# Altium project Hygrometer.PrjPcb
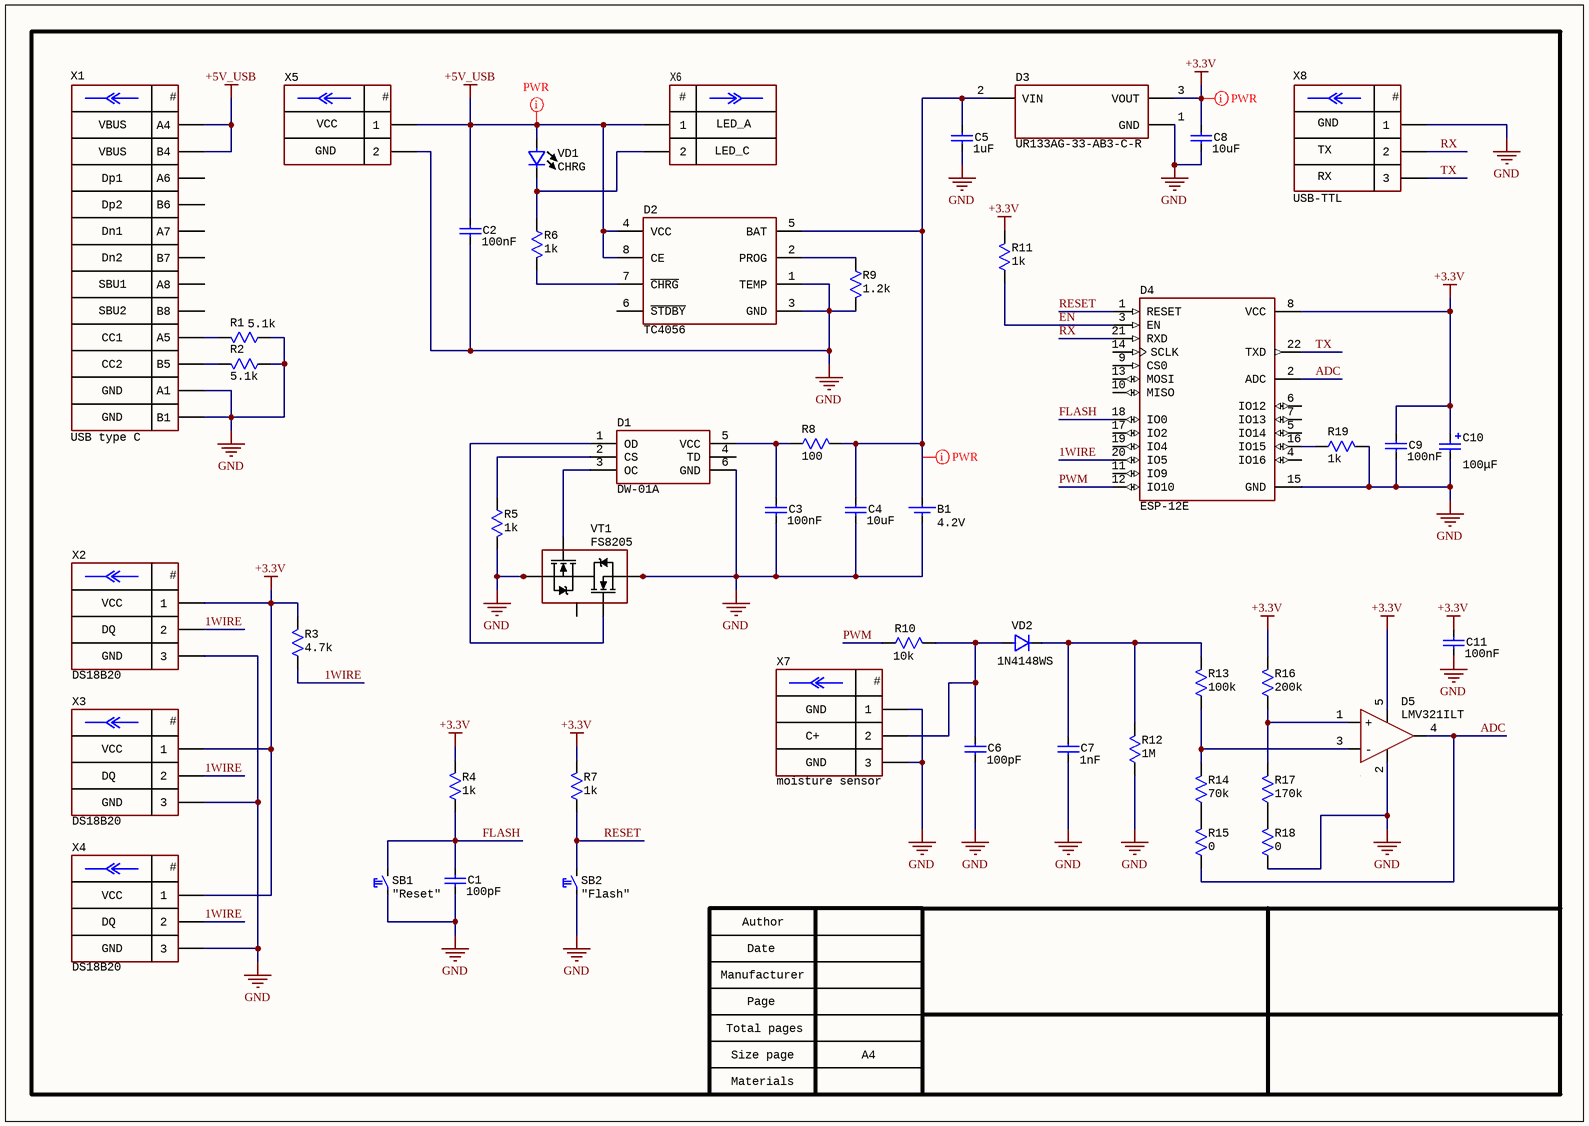
[diagram p0: Hygrometer.SchDoc]
1 sheet, 49 parts. Net scope: global (net labels, ports and power ports of the same name join across sheets).
Board file: Hygrometer.PcbDoc

## Sheet Hygrometer.SchDoc: =GlobalProjectName
size 297 x 209 mm; Scale: 1:1; Title2str: sdf; DocumentType: Схема электрическая принципиальная; FirstReferrence: АБВГ.123456.001; ApprovedBy: Утвердил; CheckedBy: Проверил; Author: Разработал; SheetNumber: 1; SheetTotal: 1; PageSetup: Record=PageOptions|CenterHorizontal=True|CenterVertical=True|PrintScale=1.00|XCorrection=1.00|YCorrection=1.00|PrintKind=1|BorderSize=5000000|LeftOffset=0|BottomOffset=0|Orientation=2|PaperLength=1000|PaperWidth=1000|Scale=100|PaperSource=15|PrintQuality=1200|MediaType=1|DitherType=10|PaperKind=A3|PrintScaleMode=1; Weight: -; ScaleFactor: -; NormInspection: Норм.Контр.

### Parts
B1  VoltageMax: 4.2V  [CON: HOLDER 18650 x1]
C1  value 100pF  [CAP: 0402]
C2  value 100nF  [CAP: 0402]
C3  value 100nF  [CAP: 0402]
C4  value 10uF  [CAP: 0805]
C5  value 1uF  [CAP: 0402]
C6  value 100pF  [CAP: 0402]
C7  value 1nF  [CAP: 0402]
C8  value 10uF  [CAP: 0805]
C9  value 100nF  [CAP: 0402]
C10  value 100μF  [CAP: TANTAL-C]
C11  value 100nF  [CAP: 0402]
D1  DW-01A  [SOT23-6]
D2  TC4056  [8-SOIC]
D3  (no value)  [SOT-89]
D4  ESP-12E  [ESP-12E]
D5  LMV321ILT  [SOT23-5]
R1  value 5.1k  [RES: 0402]
R2  value 5.1k  [RES: 0402]
R3  value 4.7k  [RES: 0402]
R4  value 1k  [RES: 0402]
R5  value 1k  [RES: 0402]
R6  value 1k  [RES: 0402]
R7  value 1k  [RES: 0402]
R8  value 100  [RES: 0402]
R9  value 1.2k  [RES: 0402]
R10  value 10k  [RES: 0402]
R11  value 1k  [RES: 0402]
R12  value 1M  [RES: 0402]
R13  value 100k  [RES: 0402]
R14  value 70k  [RES: 0402]
R15  value 0  [RES: 0402]
R16  value 200k  [RES: 0402]
R17  value 170k  [RES: 0402]
R18  value 0  [RES: 0402]
R19  value 1k  [RES: 0402]
SB1  CommentText: "Reset"  [BUT: 6x3.5 SMD]
SB2  CommentText: "Flash"  [BUT: 6x3.5 SMD]
VD1  Color: CHRG  [LED: 0402B]
VD2  PartNumber: 1N4148WS  [DIODE: SOD323]
VT1  (no value)  [8-TSOP]
X1  CommentText: USB type C  [CON: TYPE-C-31-M-12]
X2  DS18B20  [CON: PLS-3]
X3  DS18B20  [CON: PLS-3]
X4  DS18B20  [CON: PLS-3]
X5  (no value)  [CON: DG350-3.5-02P]
X6  (no value)  [CON: PLS-2]
X7  moisture sensor  [CON: PLS-3]
X8  USB-TTL  [CON: PLS-3]

### Nets
+3.3V: C8.1 C9.1 C10.1 C11.1 D3.3(VOUT) D4.8(VCC) D5.5 R3.2 R4.2 R7.2 R11.2 R16.2 X2.1 X3.1 X4.1
+5V_USB: C2.1 D2.4(VCC) D2.8(CE) VD1.1 X1.A4 X1.B4 X5.1 X6.1
GND: B1.2(-) C1.2 C2.2 C3.2 C4.2 C5.2 C6.2 C7.2 C8.2 C9.2 C10.2 C11.2 D1.6(GND) D2.1(TEMP) D2.3(GND) D3.1(GND) D4.15(GND) D5.2 R1.1 R2.1 R5.2 R9.2 R12.1 R18.1 R19.2 SB1.1 SB2.1 VT1.2(S1) VT1.3(S1) VT1.6(S2) VT1.7(S2) X1.A1 X1.B1 X2.3 X3.3 X4.3 X5.2 X7.1 X7.3 X8.1
1WIRE: D4.20(IO5) R3.1 X2.2 X3.2 X4.2
ADC: D4.2(ADC) D5.4 R15.1
EN: D4.3(EN) R11.1
FLASH: C1.1 D4.18(IO0) R4.1 SB1.2
PWM: D4.12(IO10) R10.1
RESET: D4.1(RESET) R7.1 SB2.2
RX: D4.21(RXD) X8.2
TX: D4.22(TXD) X8.3
NetB1_1: B1.1(+) C4.1 C5.1 D2.5(BAT) D3.2(VIN) R8.2
NetC3_1: C3.1 D1.5(VCC) R8.1
NetC6_1: C6.1 R10.2 VD2.1 X7.2
NetC7_1: C7.1 R12.2 R13.2 VD2.2
NetD1_1: D1.1(OD) VT1.5(G2)
NetD1_2: D1.2(CS) R5.1
NetD1_3: D1.3(OC) VT1.4(G1)
NetD2_2: D2.2(PROG) R9.1
NetD2_7: D2.7(~{CHRG}) R6.2
NetD4_16: D4.16(IO15) R19.1
NetD5_1: D5.1(+) R16.1 R17.2
NetD5_3: D5.3(-) R13.1 R14.2
NetR1_2: R1.2 X1.A5
NetR2_2: R2.2 X1.B5
NetR6_1: R6.1 VD1.2 X6.2
NetR14_1: R14.1 R15.2
NetR17_1: R17.1 R18.2
NetVT1_1: VT1.1(D12) VT1.8(D12)

Not connected (* = marked no-connect by the designer): D1 4(TD); D2 6(~{STDBY}); D4 4(IO16) 5(IO14) 6(IO12) 7(IO13) 9(CS0) 10(MISO) 11(IO9) 13(MOSI) 14(SCLK) 17(IO2) 19(IO4); X1 A6 A7 A8 B6 B7 B8

### Layout directives
net class PWR: +3.3V, +5V_USB, NetB1_1

### Notes on the sheet
- VCC
- (near X6) LED_A
- GND
- (near X6) LED_C
- RX
- TX
- DQ
- C+
- Author
- Manufacturer
- Date
- Page
- Total pages
- Size page
- A4
- Materials
- (in symbol Connector_terminal_2pin) #
- (in symbol Connector_USB_Type_C) #; VBUS; Dp1; Dp2; Dn1; Dn2; SBU1; SBU2; CC1; CC2; GND
- (in symbol PLS-2) #
- (in symbol PLS-3) #

### Library data of the parts
B1 = Holder_18650_1: Manufacturer: ALLOYSEED; ValueManufacturerPartNumber: Single holder 18650, 4.2V; PartNumber: Holder 18650; TypeConnector: Single holder 18650; HelpURL: https://ru.aliexpress.com/item/32814062027.html?spm=2114.13010708.0.0.498333edwmS6ak
C1 C6 = Ceramic: Manufacturer: Yageo; PartNumber: CC0201KRX7R7BB103; ValueManufacturerPartNumber: Ceramic capacitor, 100pF, X7R, ±10%, 16V, 0201, -55...+125°C; TypeCapacitor: Ceramic capacitor; Tolerance: ±10%; TypeDielectric: X7R; Voltage: 16V; Package: 0201; HelpURL: https://www.digikey.com/product-detail/en/yageo/CC0201KRX7R7BB103/311-1404-1-ND/2833710; Temperature: -55...+125°C
C2 C3 C9 C11 = Ceramic: Manufacturer: Yageo; PartNumber: CC0201KRX7R7BB103; ValueManufacturerPartNumber: Ceramic capacitor, 100nF, X7R, ±10%, 16V, 0201, -55...+125°C; TypeCapacitor: Ceramic capacitor; Tolerance: ±10%; TypeDielectric: X7R; Voltage: 16V; Package: 0201; HelpURL: https://www.digikey.com/product-detail/en/yageo/CC0201KRX7R7BB103/311-1404-1-ND/2833710; Temperature: -55...+125°C
C4 C8 = Ceramic: Manufacturer: Yageo; PartNumber: CC0201KRX7R7BB103; ValueManufacturerPartNumber: Ceramic capacitor, 10uF, X7R, ±10%, 16V, 0201, -55...+125°C; TypeCapacitor: Ceramic capacitor; Tolerance: ±10%; TypeDielectric: X7R; Voltage: 16V; Package: 0201; HelpURL: https://www.digikey.com/product-detail/en/yageo/CC0201KRX7R7BB103/311-1404-1-ND/2833710; Temperature: -55...+125°C
C5 = Ceramic: Manufacturer: Yageo; PartNumber: CC0201KRX7R7BB103; ValueManufacturerPartNumber: Ceramic capacitor, 1uF, X7R, ±10%, 16V, 0201, -55...+125°C; TypeCapacitor: Ceramic capacitor; Tolerance: ±10%; TypeDielectric: X7R; Voltage: 16V; Package: 0201; HelpURL: https://www.digikey.com/product-detail/en/yageo/CC0201KRX7R7BB103/311-1404-1-ND/2833710; Temperature: -55...+125°C
C7 = Ceramic: Manufacturer: Yageo; PartNumber: CC0201KRX7R7BB103; ValueManufacturerPartNumber: Ceramic capacitor, 1nF, X7R, ±10%, 16V, 0201, -55...+125°C; TypeCapacitor: Ceramic capacitor; Tolerance: ±10%; TypeDielectric: X7R; Voltage: 16V; Package: 0201; HelpURL: https://www.digikey.com/product-detail/en/yageo/CC0201KRX7R7BB103/311-1404-1-ND/2833710; Temperature: -55...+125°C
C10 = Tantal: Manufacturer: AVX; PartNumber: F930J107KAAAJ6; ValueManufacturerPartNumber: Tantalum capacitor, 100μF, 6.3V, ±10%, 2Ohm, case A (3216), -55...+125°C; Impedance: 2Ohm; Tolerance: ±10%; TypeDielectric: X7R; TypeCapacitor: Tantalum capacitor; Voltage: 6.3V; Package: case A (3216); HelpURL: https://www.digikey.com/product-detail/en/avx-corporation/F930J107KAAAJ6/478-12404-1-ND/9645231; Temperature: -55...+125°C
D1 = DW-01A: No Charging Interruption Due to Input Voltage Fluctuation, 4.5 to 6.5 V Vin, 8-pin SOT23 (TS8-8), -40 to 85 degC, Pb-Free, Mini Tape and Reel; PartNumber: LTC4056ETS8-4.2#TRMPBF; Manufacturer: Linear Technology; Max Charge Current(A): 0.7; Vin Max(V): 6.5; Battery Chemistry: Li-Ion, Li-Polymer; Number of Cells: 1; Charge Termination: On-board timer; Float Voltage: 4.2 V; Type of Charger: Linear; Vin Min(V): 4.5; Mounting Technology: Surface Mount; PackageVersion: Rev. A, 08/2010; ComponentLink3Description: Package Specification; Packing: Mini Tape and Reel; PackageReference: TS8-8; ComponentLink2URL: http://cds.linear.com/docs/en/datasheet/405642f.pdf; PackageDescription: 8-Pin Plastic TSOT-23, Body 2.9 x 1.63 mm, Pitch 0.65 mm; ComponentLink2Description: Datasheet; Code_JEDEC: MO-193; ComponentLink3URL: http://cds.linear.com/docs/en/packaging/SOT_8_05-08-1637.pdf; ComponentLink1Description: Manufacturer URL; ComponentLink1URL: http://www.linear.com/; RoHS: TRUE
D2 = TC4056: No Charging Interruption Due to Input Voltage Fluctuation, 4.5 to 6.5 V Vin, 8-pin SOT23 (TS8-8), -40 to 85 degC, Pb-Free, Mini Tape and Reel; PartNumber: LTC4056ETS8-4.2#TRMPBF; Manufacturer: Linear Technology; Max Charge Current(A): 0.7; Vin Max(V): 6.5; Battery Chemistry: Li-Ion, Li-Polymer; Number of Cells: 1; Charge Termination: On-board timer; Float Voltage: 4.2 V; Type of Charger: Linear; Vin Min(V): 4.5; Mounting Technology: Surface Mount; PackageVersion: Rev. A, 08/2010; ComponentLink3Description: Package Specification; Packing: Mini Tape and Reel; PackageReference: TS8-8; ComponentLink2URL: http://cds.linear.com/docs/en/datasheet/405642f.pdf; PackageDescription: 8-Pin Plastic TSOT-23, Body 2.9 x 1.63 mm, Pitch 0.65 mm; ComponentLink2Description: Datasheet; Code_JEDEC: MO-193; ComponentLink3URL: http://cds.linear.com/docs/en/packaging/SOT_8_05-08-1637.pdf; ComponentLink1Description: Manufacturer URL; ComponentLink1URL: http://www.linear.com/; RoHS: TRUE
D3 = UR133AG-33-AB3-C-R: Linear voltage regulator; Manufacturer: Diodes Incorporated; ValueManufacturerPartNumber: Linear voltage regulator, input 2.5...6V, 0.7V, output 1.8V, 0.3A, -40...+85°C, SOT23-5; VoltageInput: input 2.5...6V; MaxDropout: 0.7V; CurrentOutput: 0.3A; VoltageOutput: output 1.8V; HelpURL: https://www.digikey.com/en/products/detail/diodes-incorporated/AP2127K-1-8TRG1/4470784; Package: SOT23-5; ComponentType: Linear voltage regulator; Temperature: -40...+85°C; PartNumber: UR133AG-33-AB3-C-R
D5 = LMV321ILT: Comparator; Manufacturer: Microchip Technology; ValueManufacturerPartNumber: IC comparator, Rail-to-Rail, 1.6...5.5V, -40...+85°C, SOT23-5; Supply: 1.6...5.5V; OutputType: Rail-to-Rail; HelpURL: https://www.digikey.com/product-detail/en/microchip-technology/MCP6541T-I-OT/MCP6541T-I-OTCT-ND/3622387; Package: SOT23-5; ComponentType: IC comparator; Temperature: -40...+85°C
R1 R2 = Resistor: Manufacturer: Yageo; PartNumber: RC0201JR-07100RL; ValueManufacturerPartNumber: Resistor film, 5.1k, ±5%, 0201, 0.05W, -55...+125°C; TypeResistor: Resistor film; Power: 0.05W; Tolerance: ±5%; Package: 0201; HelpURL: https://www.digikey.com/product-detail/en/yageo/RC0201JR-07100RL/311-100NCT-ND/1949006; Temperature: -55...+125°C
R3 = Resistor: Manufacturer: Yageo; PartNumber: RC0201JR-07100RL; ValueManufacturerPartNumber: Resistor film, 4.7k, ±5%, 0201, 0.05W, -55...+125°C; TypeResistor: Resistor film; Power: 0.05W; Tolerance: ±5%; Package: 0201; HelpURL: https://www.digikey.com/product-detail/en/yageo/RC0201JR-07100RL/311-100NCT-ND/1949006; Temperature: -55...+125°C
R4-R7 R11 R19 = Resistor: Manufacturer: Yageo; PartNumber: RC0201JR-07100RL; ValueManufacturerPartNumber: Resistor film, 1k, ±5%, 0201, 0.05W, -55...+125°C; TypeResistor: Resistor film; Power: 0.05W; Tolerance: ±5%; Package: 0201; HelpURL: https://www.digikey.com/product-detail/en/yageo/RC0201JR-07100RL/311-100NCT-ND/1949006; Temperature: -55...+125°C
R8 = Resistor: Manufacturer: Yageo; PartNumber: RC0201JR-07100RL; ValueManufacturerPartNumber: Resistor film, 100, ±5%, 0201, 0.05W, -55...+125°C; TypeResistor: Resistor film; Power: 0.05W; Tolerance: ±5%; Package: 0201; HelpURL: https://www.digikey.com/product-detail/en/yageo/RC0201JR-07100RL/311-100NCT-ND/1949006; Temperature: -55...+125°C
R9 = Resistor: Manufacturer: Yageo; PartNumber: RC0201JR-07100RL; ValueManufacturerPartNumber: Resistor film, 1.2k, ±5%, 0201, 0.05W, -55...+125°C; TypeResistor: Resistor film; Power: 0.05W; Tolerance: ±5%; Package: 0201; HelpURL: https://www.digikey.com/product-detail/en/yageo/RC0201JR-07100RL/311-100NCT-ND/1949006; Temperature: -55...+125°C
R10 = Resistor: Manufacturer: Yageo; PartNumber: RC0201JR-07100RL; ValueManufacturerPartNumber: Resistor film, 10k, ±5%, 0201, 0.05W, -55...+125°C; TypeResistor: Resistor film; Power: 0.05W; Tolerance: ±5%; Package: 0201; HelpURL: https://www.digikey.com/product-detail/en/yageo/RC0201JR-07100RL/311-100NCT-ND/1949006; Temperature: -55...+125°C
R12 = Resistor: Manufacturer: Yageo; PartNumber: RC0201JR-07100RL; ValueManufacturerPartNumber: Resistor film, 1M, ±5%, 0201, 0.05W, -55...+125°C; TypeResistor: Resistor film; Power: 0.05W; Tolerance: ±5%; Package: 0201; HelpURL: https://www.digikey.com/product-detail/en/yageo/RC0201JR-07100RL/311-100NCT-ND/1949006; Temperature: -55...+125°C
R13 = Resistor: Manufacturer: Yageo; PartNumber: RC0201JR-07100RL; ValueManufacturerPartNumber: Resistor film, 100k, ±5%, 0201, 0.05W, -55...+125°C; TypeResistor: Resistor film; Power: 0.05W; Tolerance: ±5%; Package: 0201; HelpURL: https://www.digikey.com/product-detail/en/yageo/RC0201JR-07100RL/311-100NCT-ND/1949006; Temperature: -55...+125°C
R14 = Resistor: Manufacturer: Yageo; PartNumber: RC0201JR-07100RL; ValueManufacturerPartNumber: Resistor film, 70k, ±5%, 0201, 0.05W, -55...+125°C; TypeResistor: Resistor film; Power: 0.05W; Tolerance: ±5%; Package: 0201; HelpURL: https://www.digikey.com/product-detail/en/yageo/RC0201JR-07100RL/311-100NCT-ND/1949006; Temperature: -55...+125°C
R15 R18 = Resistor: Manufacturer: Yageo; PartNumber: RC0201JR-07100RL; ValueManufacturerPartNumber: Resistor film, 0, ±5%, 0201, 0.05W, -55...+125°C; TypeResistor: Resistor film; Power: 0.05W; Tolerance: ±5%; Package: 0201; HelpURL: https://www.digikey.com/product-detail/en/yageo/RC0201JR-07100RL/311-100NCT-ND/1949006; Temperature: -55...+125°C
R16 = Resistor: Manufacturer: Yageo; PartNumber: RC0201JR-07100RL; ValueManufacturerPartNumber: Resistor film, 200k, ±5%, 0201, 0.05W, -55...+125°C; TypeResistor: Resistor film; Power: 0.05W; Tolerance: ±5%; Package: 0201; HelpURL: https://www.digikey.com/product-detail/en/yageo/RC0201JR-07100RL/311-100NCT-ND/1949006; Temperature: -55...+125°C
R17 = Resistor: Manufacturer: Yageo; PartNumber: RC0201JR-07100RL; ValueManufacturerPartNumber: Resistor film, 170k, ±5%, 0201, 0.05W, -55...+125°C; TypeResistor: Resistor film; Power: 0.05W; Tolerance: ±5%; Package: 0201; HelpURL: https://www.digikey.com/product-detail/en/yageo/RC0201JR-07100RL/311-100NCT-ND/1949006; Temperature: -55...+125°C
SB1 SB2 = Button_tactile: Manufacturer: TE Connectivity; ValueManufacturerPartNumber: Tactile button, 6x6mm; PartNumber: FSM2JSMAATR; TypeButton: Tactile button; HelpURL: https://www.digikey.com/product-detail/en/te-connectivity-alcoswitch-switches/FSM2JSMAATR/450-1792-1-ND/3503931; Package: 6x6mm
VD1 = LED_single: ValueManufacturerPartNumber: LED, Green, *, *, *, -55...+150°C; TypeDiode: LED; ColorParameter: Green; Manufacturer: *; Package: *; HelpURL: *; Temperature: -55...+150°C; Current: *; VoltageDrop: *; PartNumber: *
VD2 = Diode_single: Manufacturer: Micro Commercial; ValueManufacturerPartNumber: Single diode, 75V, 150mA, 1V, 4ns, SOD-323, -55...+150°C; TypeDiode: Single diode; Voltage: 75V; Current: 150mA; VoltageDrop: 1V; RecoveryTime: 4ns; Package: SOD-323; HelpURL: https://www.digikey.com/product-detail/en/micro-commercial-co/1N4148WX-TP/1N4148WXTPMSCT-ND/717312; Temperature: -55...+150°C
VT1 = FS8205: Manufacturer: Infineon Technologies; ValueManufacturerPartNumber: MOSFET N-channel transistor, 80V, 7A, 9.1nC, 2.5W, 34mOhm, 756pF, 8-TDSON, -55...+150°C; TypeTransistor: MOSFET N-channel transistor; VoltageDS: 80V; CurrentDS: 7A; RDS: 34mOhm; GateCharge: 9.1nC; InputCapacitor: 756pF; MaxPower: 2.5W; Package: 8-TDSON; HelpURL: https://www.digikey.com/product-detail/en/infineon-technologies/BSC340N08NS3GATMA1/BSC340N08NS3GATMA1TR-ND/2080655; Temperature: -55...+150°C; PartNumber: FS8205
X1 = Connector_USB_Type_C: Manufacturer: Korean Hroparts; ValueManufacturerPartNumber: USB Type C, 3A; PartNumber: TYPE-C-31-M-12; CurrentMax: 3A; HelpURL: https://lcsc.com/product-detail/USB-Type-C_Korean-Hroparts-Elec-TYPE-C-31-M-12_C165948.html; TypeConnector: USB Type C
X2-X4 X7 X8 = PLS-3: Manufacturer: Connfly; ValueManufacturerPartNumber: Connector, 3pin, 2.54mm, 500VAC, 3A; TypeConnector: Connector; VoltageMax: 500VAC; Pitch: 2.54mm; CurrentMax: 3A; Multichannel: 3pin; CommentText: "Разъем"; HelpURL: https://www.chipdip.ru/product/pls-3; PartNumber: PLS-3
X5 = Connector_terminal_2pin: Manufacturer: Degson; ValueManufacturerPartNumber: Terminal connector, 2pin, 3.5mm, 300VAC, 10A; PartNumber: DG350-3.5-02P-14; TypeConnector: Terminal connector; VoltageMax: 300VAC; Pitch: 3.5mm; CurrentMax: 10A; Multichannel: 2pin; CommentText: "Разъем"; HelpURL: https://www.chipdip.ru/product/dg350-3.5-02p-12
X6 = PLS-2: Manufacturer: Connfly; ValueManufacturerPartNumber: Connector, 2pin, 2.54mm, 500VAC, 3A; TypeConnector: Connector; VoltageMax: 500VAC; Pitch: 2.54mm; CurrentMax: 3A; Multichannel: 2pin; CommentText: "Разъем"; HelpURL: https://www.chipdip.ru/product/pls-2; PartNumber: PLS-2